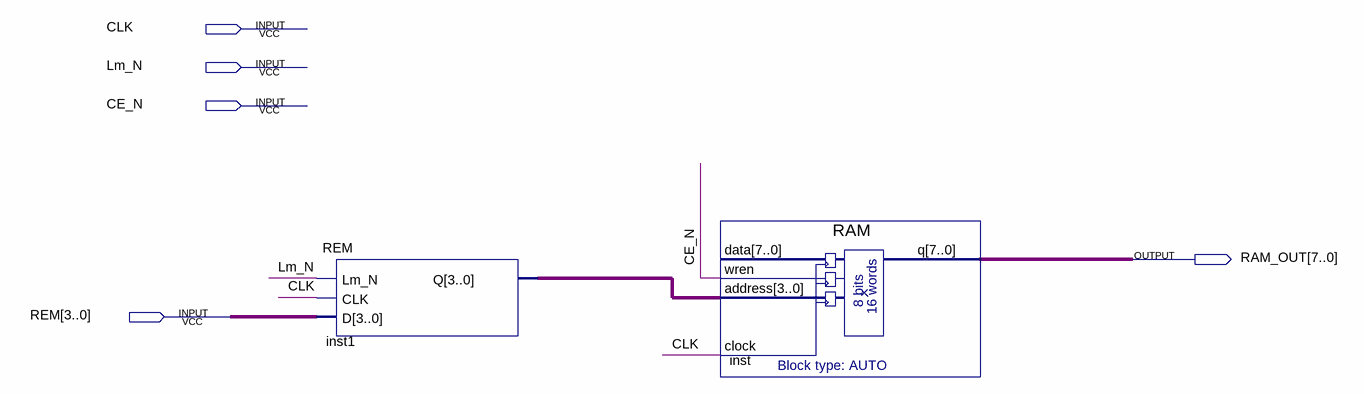
[diagram p0: schematic sheet]
// Quartus schematic REM_RAM.bdf as structural Verilog: 2 symbols, 5 pins
module REM_RAM (
  input  CLK,
  input  Lm_N,
  input  CE_N,
  input  [3:0] REM,
  output [7:0] RAM_OUT
);

  wire [3:0] inst1_q;

  REM inst1 (.Lm_N(Lm_N), .CLK(CLK), .D(REM), .Q(inst1_q));
  RAM inst (.wren(CE_N), .address(inst1_q), .clock(CLK), .q(RAM_OUT));  // open: data
endmodule
